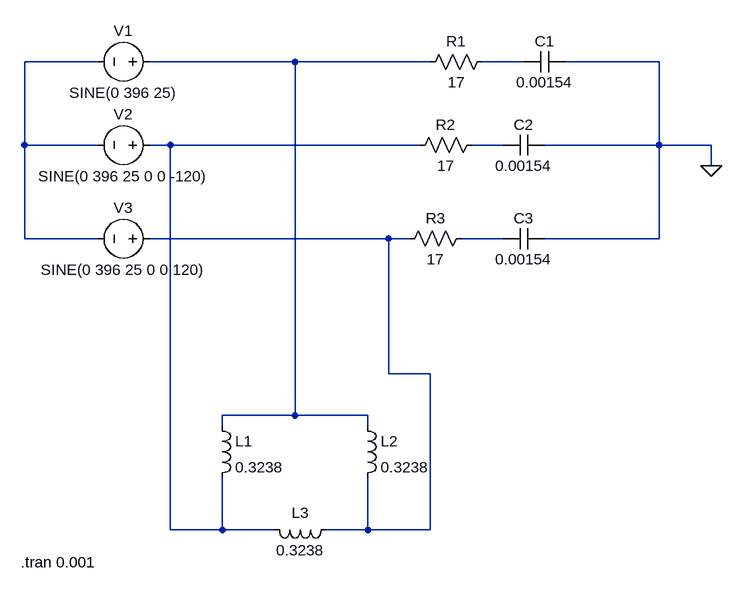
[diagram p0: schematic specialtask3.asc]
specialtask3.asc, the LTspice schematic file:
Version 4
SHEET 1 880 680
WIRE -272 -304 -384 -304
WIRE 32 -304 -192 -304
WIRE 240 -304 32 -304
WIRE 384 -304 320 -304
WIRE 592 -304 448 -304
WIRE -384 -176 -384 -304
WIRE -272 -176 -384 -176
WIRE -160 -176 -192 -176
WIRE 224 -176 -160 -176
WIRE 352 -176 304 -176
WIRE 592 -176 592 -304
WIRE 592 -176 416 -176
WIRE 672 -176 592 -176
WIRE 672 -144 672 -176
WIRE -384 -32 -384 -176
WIRE -272 -32 -384 -32
WIRE 176 -32 -192 -32
WIRE 208 -32 176 -32
WIRE 352 -32 288 -32
WIRE 592 -32 592 -176
WIRE 592 -32 416 -32
WIRE 176 176 176 -32
WIRE 240 176 176 176
WIRE 32 240 32 -304
WIRE 32 240 -80 240
WIRE 144 240 32 240
WIRE -80 256 -80 240
WIRE 144 256 144 240
WIRE -160 416 -160 -176
WIRE -80 416 -80 336
WIRE -80 416 -160 416
WIRE 0 416 -80 416
WIRE 144 416 144 336
WIRE 144 416 80 416
WIRE 240 416 240 176
WIRE 240 416 144 416
FLAG 672 -144 0
SYMBOL ind -96 240 R0
SYMATTR InstName L1
SYMATTR Value 0.3238
SYMBOL ind 128 240 R0
SYMATTR InstName L2
SYMATTR Value 0.3238
SYMBOL ind 96 400 R90
WINDOW 0 5 56 VBottom 2
WINDOW 3 32 56 VTop 2
SYMATTR InstName L3
SYMATTR Value 0.3238
SYMBOL voltage -176 -304 R90
WINDOW 0 -32 56 VBottom 2
WINDOW 3 32 56 VTop 2
WINDOW 123 0 0 Left 0
WINDOW 39 0 0 Left 0
SYMATTR InstName V1
SYMATTR Value SINE(0 396 25)
SYMBOL voltage -176 -176 R90
WINDOW 0 -32 56 VBottom 2
WINDOW 3 32 56 VTop 2
WINDOW 123 0 0 Left 0
WINDOW 39 0 0 Left 0
SYMATTR InstName V2
SYMATTR Value SINE(0 396 25 0 0 -120)
SYMBOL voltage -176 -32 R90
WINDOW 0 -32 56 VBottom 2
WINDOW 3 32 56 VTop 2
WINDOW 123 0 0 Left 0
WINDOW 39 0 0 Left 0
SYMATTR InstName V3
SYMATTR Value SINE(0 396 25 0 0 120)
SYMBOL res 336 -320 R90
WINDOW 0 0 56 VBottom 2
WINDOW 3 32 56 VTop 2
SYMATTR InstName R1
SYMATTR Value 17
SYMBOL res 320 -192 R90
WINDOW 0 0 56 VBottom 2
WINDOW 3 32 56 VTop 2
SYMATTR InstName R2
SYMATTR Value 17
SYMBOL res 304 -48 R90
WINDOW 0 0 56 VBottom 2
WINDOW 3 32 56 VTop 2
SYMATTR InstName R3
SYMATTR Value 17
SYMBOL cap 448 -320 R90
WINDOW 0 0 32 VBottom 2
WINDOW 3 32 32 VTop 2
SYMATTR InstName C1
SYMATTR Value 0.00154
SYMBOL cap 416 -192 R90
WINDOW 0 0 32 VBottom 2
WINDOW 3 32 32 VTop 2
SYMATTR InstName C2
SYMATTR Value 0.00154
SYMBOL cap 416 -48 R90
WINDOW 0 0 32 VBottom 2
WINDOW 3 32 32 VTop 2
SYMATTR InstName C3
SYMATTR Value 0.00154
TEXT -390 466 Left 2 !.tran 0.001

The netlist it stands for:
* specialtask3.asc
L1 N002 N004 0.3238
L2 N002 N006 0.3238
L3 N006 N004 0.3238
V1 N002 N001 SINE(0 396 25)
V2 N004 N001 SINE(0 396 25 0 0 -120)
V3 N006 N001 SINE(0 396 25 0 0 120)
R1 N003 N002 17
R2 N005 N004 17
R3 N007 N006 17
C1 0 N003 0.00154
C2 0 N005 0.00154
C3 0 N007 0.00154
.tran 0.001
.backanno
.end